# Altium schematic sheet testboard_chip1_wafertest.SchDoc
size E
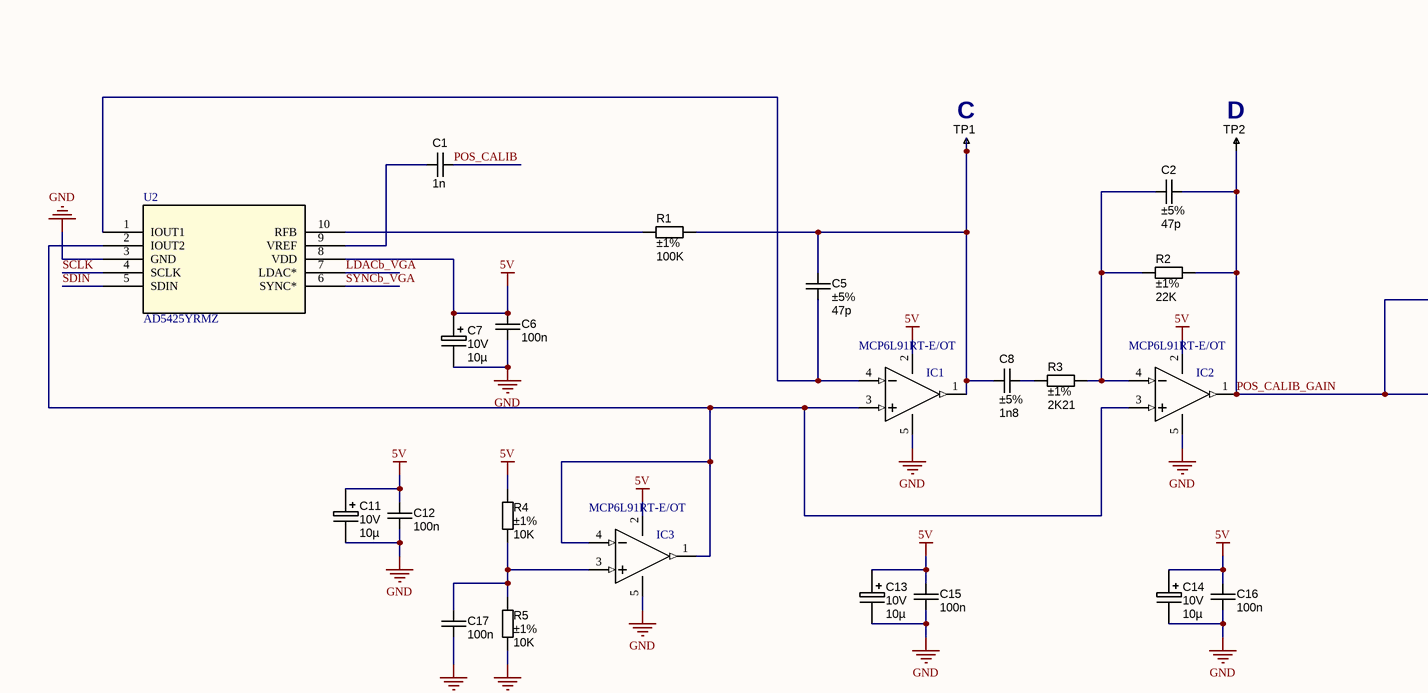
[diagram p0: testboard_chip1_wafertest.SchDoc, top left]
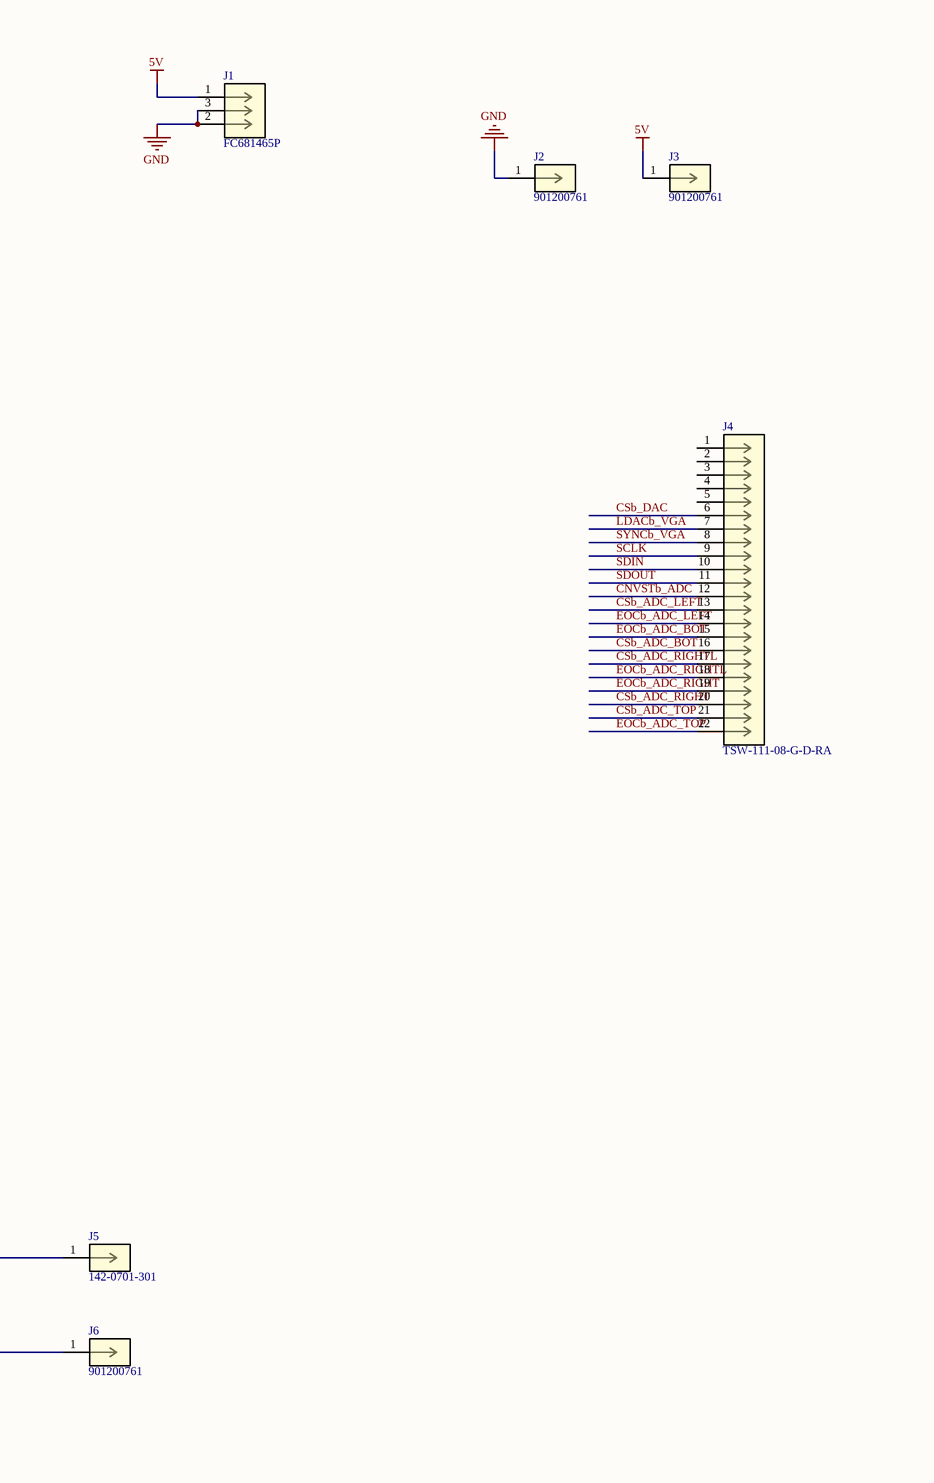
[diagram p1: testboard_chip1_wafertest.SchDoc, top middle]
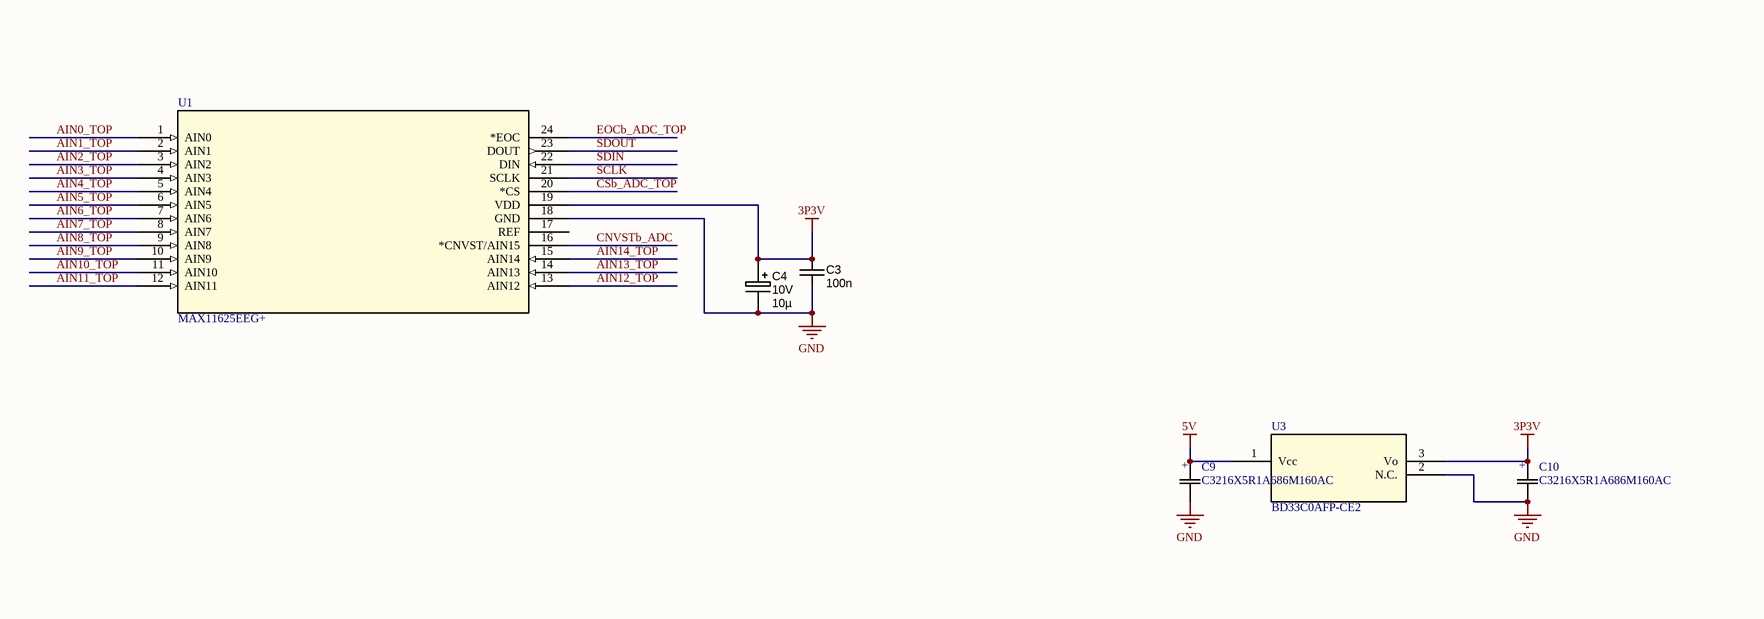
[diagram p2: testboard_chip1_wafertest.SchDoc, top right]
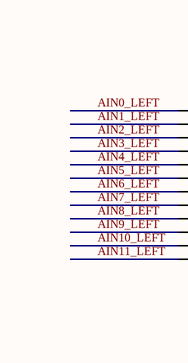
[diagram p3: testboard_chip1_wafertest.SchDoc, bottom left]
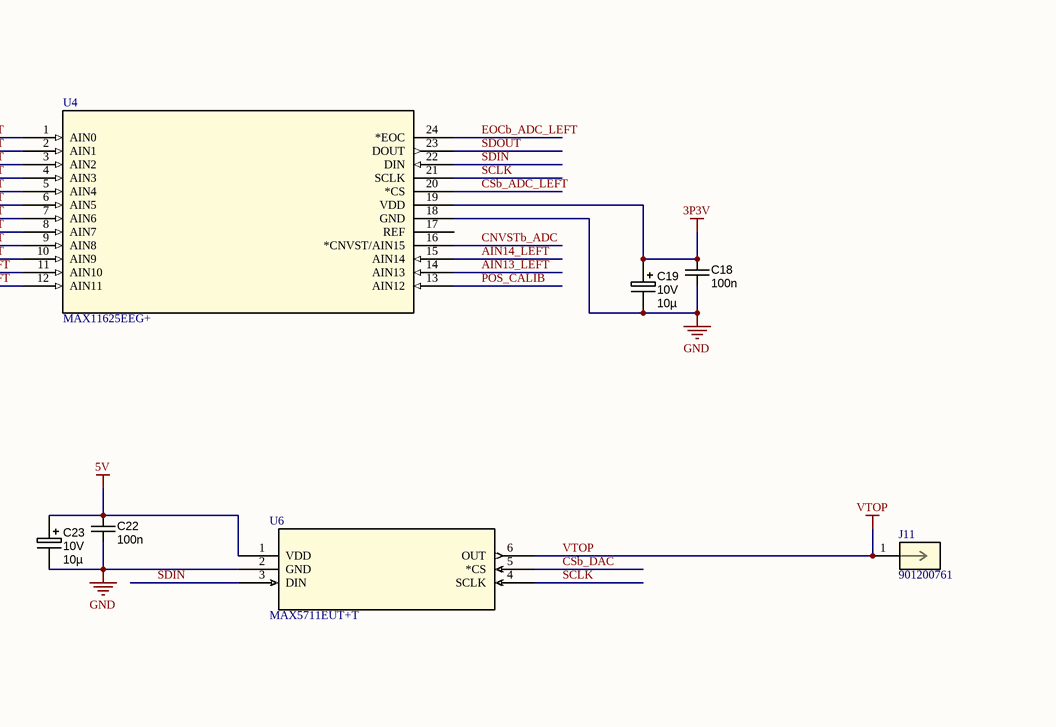
[diagram p4: testboard_chip1_wafertest.SchDoc, bottom middle]
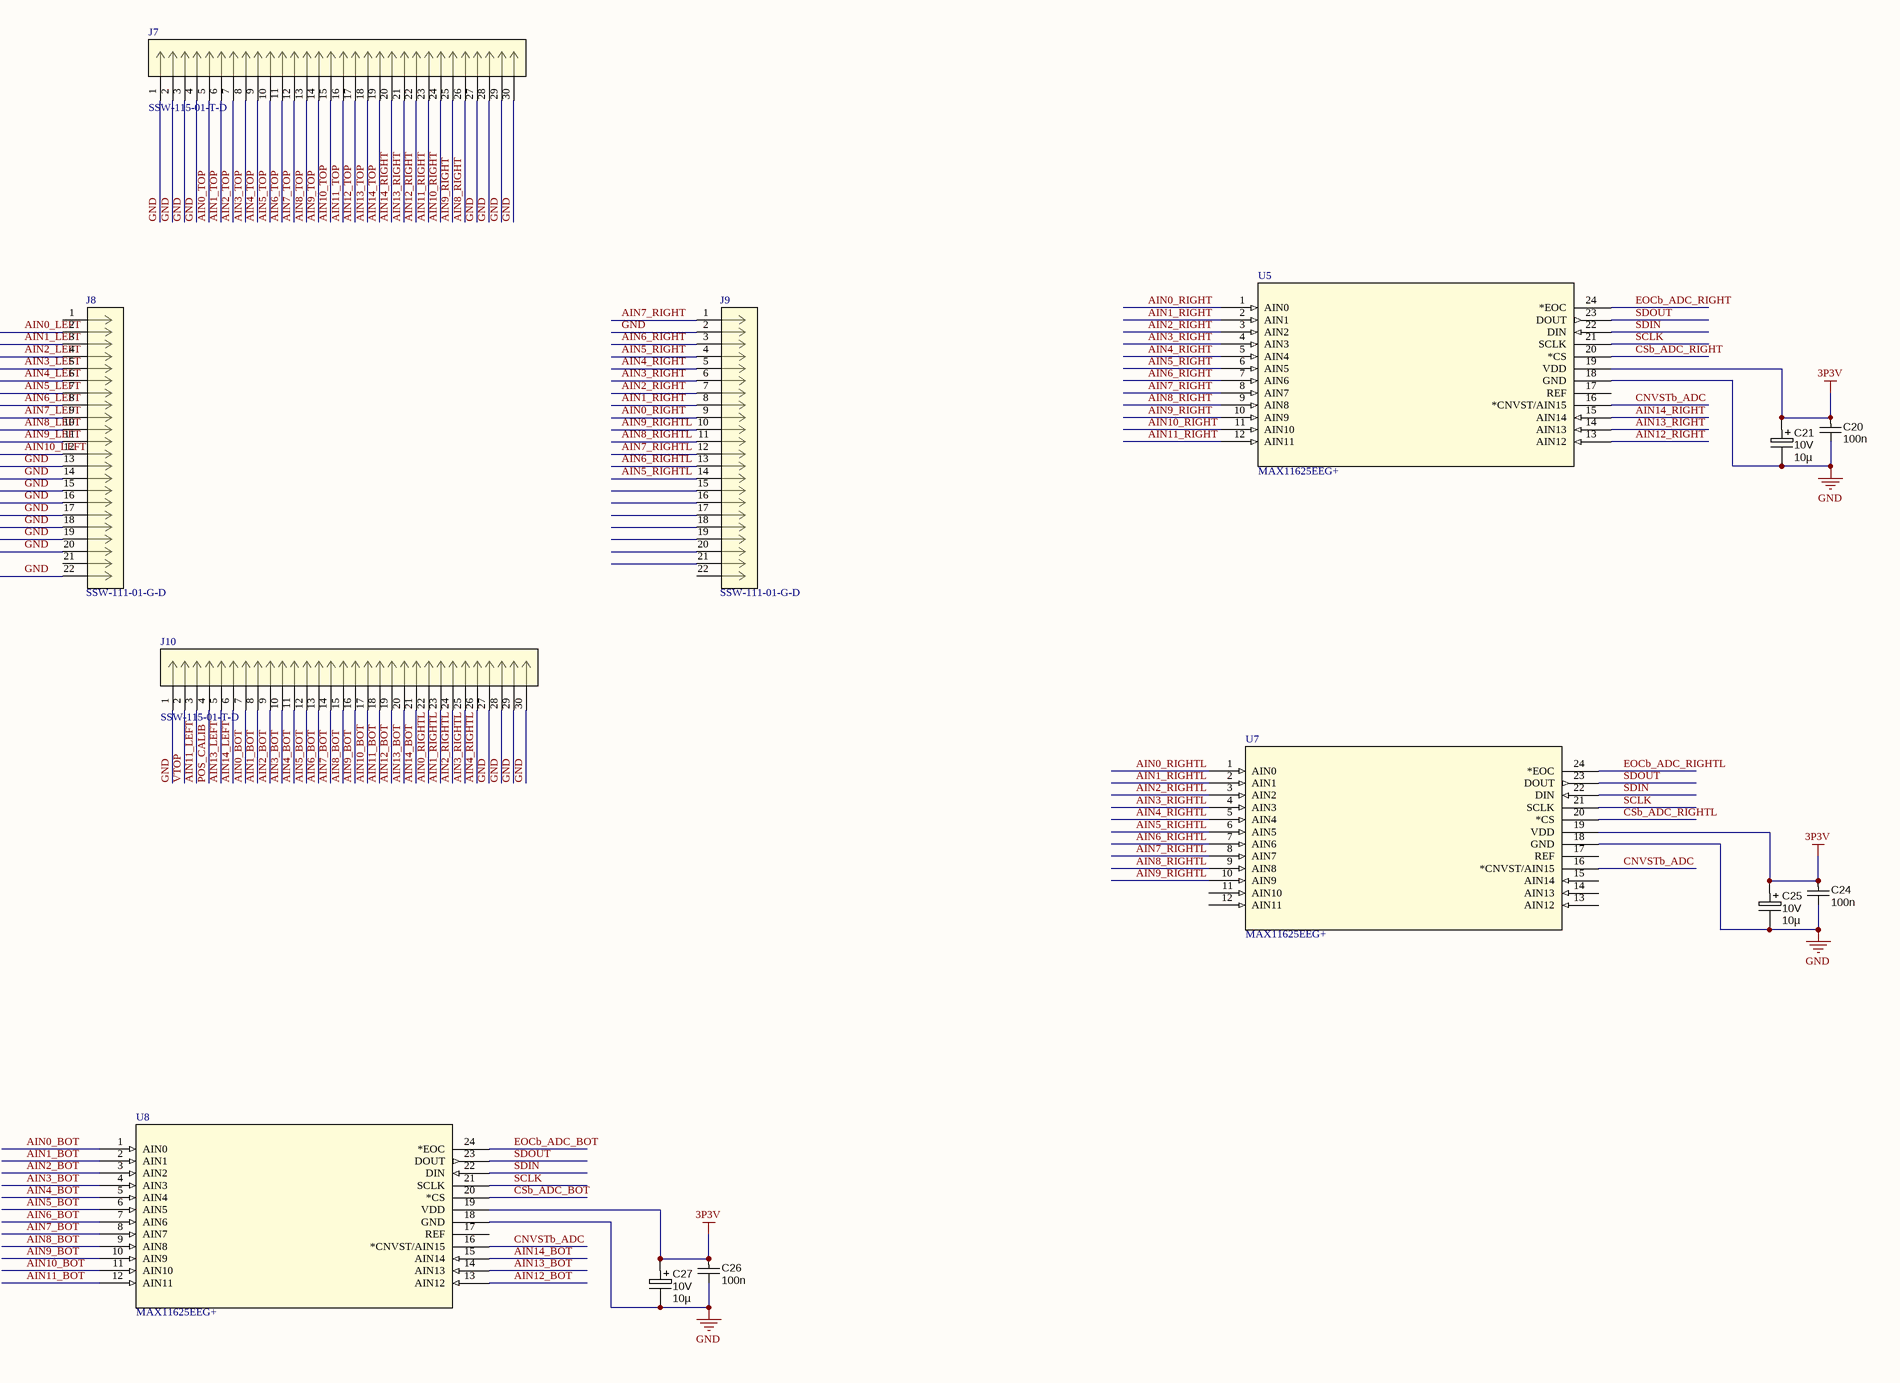
[diagram p5: testboard_chip1_wafertest.SchDoc, bottom right]

## Parts
C1  value 1n  [CAPC1608N]  (hidden comment: approved sub OK)
C2  Tolerance: ±5%  [CAPC1608N]  (hidden comment: 47p)
C3  value 100n  [CAPC1608N]  (hidden comment: approved sub OK)
C4  Ratings: 10V  [CAPMP2012X150USR]  (hidden comment: 10µ)
C5  Tolerance: ±5%  [CAPC1608N]  (hidden comment: 47p)
C6  value 100n  [CAPC1608N]  (hidden comment: approved sub OK)
C7  Ratings: 10V  [CAPMP2012X150USR]  (hidden comment: 10µ)
C8  Tolerance: ±5%  [CAPC1608N]  (hidden comment: 1n8)
C9  C3216X5R1A686M160AC  [CAP_3216_TDK]
C10  C3216X5R1A686M160AC  [CAP_3216_TDK]
C11  Ratings: 10V  [CAPMP2012X150USR]  (hidden comment: 10µ)
C12  value 100n  [CAPC1608N]  (hidden comment: approved sub OK)
C13  Ratings: 10V  [CAPMP2012X150USR]  (hidden comment: 10µ)
C14  Ratings: 10V  [CAPMP2012X150USR]  (hidden comment: 10µ)
C15  value 100n  [CAPC1608N]  (hidden comment: approved sub OK)
C16  value 100n  [CAPC1608N]  (hidden comment: approved sub OK)
C17  value 100n  [CAPC1608N]  (hidden comment: approved sub OK)
C18  value 100n  [CAPC1608N]  (hidden comment: approved sub OK)
C19  Ratings: 10V  [CAPMP2012X150USR]  (hidden comment: 10µ)
C20  value 100n  [CAPC1608N]  (hidden comment: approved sub OK)
C21  Ratings: 10V  [CAPMP2012X150USR]  (hidden comment: 10µ)
C22  value 100n  [CAPC1608N]  (hidden comment: approved sub OK)
C23  Ratings: 10V  [CAPMP2012X150USR]  (hidden comment: 10µ)
C24  value 100n  [CAPC1608N]  (hidden comment: approved sub OK)
C25  Ratings: 10V  [CAPMP2012X150USR]  (hidden comment: 10µ)
C26  value 100n  [CAPC1608N]  (hidden comment: approved sub OK)
C27  Ratings: 10V  [CAPMP2012X150USR]  (hidden comment: 10µ)
IC1  MCP6L91RT-E/OT  [SOT23-5]
IC2  MCP6L91RT-E/OT  [SOT23-5]
IC3  MCP6L91RT-E/OT  [SOT23-5]
J1  FC681465P  [CONN3_FC681465P_CLF]
J2  901200761  [CONN_90120-0761_MOL]
J3  901200761  [CONN_90120-0761_MOL]
J4  TSW-111-08-G-D-RA  [CON23_2X11_TR_TSW_SAI]
J5  142-0701-301  [CONN_142-0701-301_CIN]
J6  901200761  [CONN_90120-0761_MOL]
J7  SSW-115-01-T-D  [CON30_2X15_TU_SSQ]
J8  SSW-111-01-G-D  [CON23_2X11_TU_SSQ]
J9  SSW-111-01-G-D  [CON23_2X11_TU_SSQ]
J10  SSW-115-01-T-D  [CON30_2X15_TU_SSQ]
J11  901200761  [CONN_90120-0761_MOL]
R1  value 100K  Tolerance: ±1%  [RESC1608N]  (hidden comment: Thick Film)
R2  value 22K  Tolerance: ±1%  [RESC1608N]  (hidden comment: Thick Film)
R3  value 2K21  Tolerance: ±1%  [RESC1608N]  (hidden comment: Thick Film)
R4  value 10K  Tolerance: ±1%  [RESC1608N]  (hidden comment: Thick Film)
R5  value 10K  Tolerance: ±1%  [RESC1608N]  (hidden comment: Thick Film)
TP1  TESTPOINT_THT_MINI  [TP-THT-MINI]  (value not drawn)
TP2  TESTPOINT_THT_MINI  [TP-THT-MINI]  (value not drawn)
U1  MAX11625EEG+  [21-0055H_24_MXM]
U2  AD5425YRMZ  [RM_10_ADI]
U3  BD33C0AFP-CE2  [TO252-3_ROM]
U4  MAX11625EEG+  [21-0055H_24_MXM]
U5  MAX11625EEG+  [21-0055H_24_MXM]
U6  MAX5711EUT+T  [21-0058I_MXM]
U7  MAX11625EEG+  [21-0055H_24_MXM]
U8  MAX11625EEG+  [21-0055H_24_MXM]

## Nets
3P3V: C3.1 C4.1 C10.1 C18.1 C19.1 C20.1 C21.1 C24.1 C25.1 C26.1 C27.1 U1.19(VDD) U3.3(Vo) U4.19(VDD) U5.19(VDD) U7.19(VDD) U8.19(VDD)
5V: C6.1 C7.1 C9.1 C11.1 C12.1 C13.1 C14.1 C15.1 C16.1 C22.1 C23.1 IC1.2(V+) IC2.2(V+) IC3.2(V+) J1.1 J3.1 R4.1 U2.8(VDD) U3.1(Vcc) U6.1(VDD)
GND: C3.2 C4.2 C6.2 C7.2 C9.2 C10.2 C11.2 C12.2 C13.2 C14.2 C15.2 C16.2 C17.2 C18.2 C19.2 C20.2 C21.2 C22.2 C23.2 C24.2 C25.2 C26.2 C27.2 IC1.5(V-) IC2.5(V-) IC3.5(V-) J1.2 J1.3 J2.1 J7.1 J7.2 J7.3 J7.4 J7.27 J7.28 J7.29 J7.30 J8.13 J8.14 J8.15 J8.16 J8.17 J8.18 J8.19 J8.20 J8.22 J9.2 J10.1 J10.27 J10.28 J10.29 J10.30 R5.2 U1.18(GND) U2.3(GND) U3.2(N.C.) U4.18(GND) U5.18(GND) U6.2(GND) U7.18(GND) U8.18(GND)
VTOP: J10.2 J11.1 U6.6(OUT)
AIN0_BOT: J10.7 U8.1(AIN0)
AIN0_LEFT: J8.2 U4.1(AIN0)
AIN0_RIGHT: J9.9 U5.1(AIN0)
AIN0_RIGHTL: J10.22 U7.1(AIN0)
AIN0_TOP: J7.5 U1.1(AIN0)
AIN1_BOT: J10.8 U8.2(AIN1)
AIN1_LEFT: J8.3 U4.2(AIN1)
AIN1_RIGHT: J9.8 U5.2(AIN1)
AIN1_RIGHTL: J10.23 U7.2(AIN1)
AIN1_TOP: J7.6 U1.2(AIN1)
AIN2_BOT: J10.9 U8.3(AIN2)
AIN2_LEFT: J8.4 U4.3(AIN2)
AIN2_RIGHT: J9.7 U5.3(AIN2)
AIN2_RIGHTL: J10.24 U7.3(AIN2)
AIN2_TOP: J7.7 U1.3(AIN2)
AIN3_BOT: J10.10 U8.4(AIN3)
AIN3_LEFT: J8.5 U4.4(AIN3)
AIN3_RIGHT: J9.6 U5.4(AIN3)
AIN3_RIGHTL: J10.25 U7.4(AIN3)
AIN3_TOP: J7.8 U1.4(AIN3)
AIN4_BOT: J10.11 U8.5(AIN4)
AIN4_LEFT: J8.6 U4.5(AIN4)
AIN4_RIGHT: J9.5 U5.5(AIN4)
AIN4_RIGHTL: J10.26 U7.5(AIN4)
AIN4_TOP: J7.9 U1.5(AIN4)
AIN5_BOT: J10.12 U8.6(AIN5)
AIN5_LEFT: J8.7 U4.6(AIN5)
AIN5_RIGHT: J9.4 U5.6(AIN5)
AIN5_RIGHTL: J9.14 U7.6(AIN5)
AIN5_TOP: J7.10 U1.6(AIN5)
AIN6_BOT: J10.13 U8.7(AIN6)
AIN6_LEFT: J8.8 U4.7(AIN6)
AIN6_RIGHT: J9.3 U5.7(AIN6)
AIN6_RIGHTL: J9.13 U7.7(AIN6)
AIN6_TOP: J7.11 U1.7(AIN6)
AIN7_BOT: J10.14 U8.8(AIN7)
AIN7_LEFT: J8.9 U4.8(AIN7)
AIN7_RIGHT: J9.1 U5.8(AIN7)
AIN7_RIGHTL: J9.12 U7.8(AIN7)
AIN7_TOP: J7.12 U1.8(AIN7)
AIN8_BOT: J10.15 U8.9(AIN8)
AIN8_LEFT: J8.10 U4.9(AIN8)
AIN8_RIGHT: J7.26 U5.9(AIN8)
AIN8_RIGHTL: J9.11 U7.9(AIN8)
AIN8_TOP: J7.13 U1.9(AIN8)
AIN9_BOT: J10.16 U8.10(AIN9)
AIN9_LEFT: J8.11 U4.10(AIN9)
AIN9_RIGHT: J7.25 U5.10(AIN9)
AIN9_RIGHTL: J9.10 U7.10(AIN9)
AIN9_TOP: J7.14 U1.10(AIN9)
AIN10_BOT: J10.17 U8.11(AIN10)
AIN10_LEFT: J8.12 U4.11(AIN10)
AIN10_RIGHT: J7.24 U5.11(AIN10)
AIN10_TOP: J7.15 U1.11(AIN10)
AIN11_BOT: J10.18 U8.12(AIN11)
AIN11_LEFT: J10.3 U4.12(AIN11)
AIN11_RIGHT: J7.23 U5.12(AIN11)
AIN11_TOP: J7.16 U1.12(AIN11)
AIN12_BOT: J10.19 U8.13(AIN12)
AIN12_RIGHT: J7.22 U5.13(AIN12)
AIN12_TOP: J7.17 U1.13(AIN12)
AIN13_BOT: J10.20 U8.14(AIN13)
AIN13_LEFT: J10.5 U4.14(AIN13)
AIN13_RIGHT: J7.21 U5.14(AIN13)
AIN13_TOP: J7.18 U1.14(AIN13)
AIN14_BOT: J10.21 U8.15(AIN14)
AIN14_LEFT: J10.6 U4.15(AIN14)
AIN14_RIGHT: J7.20 U5.15(AIN14)
AIN14_TOP: J7.19 U1.15(AIN14)
CNVSTb_ADC: J4.12 U1.16(*CNVST/AIN15) U4.16(*CNVST/AIN15) U5.16(*CNVST/AIN15) U7.16(*CNVST/AIN15) U8.16(*CNVST/AIN15)
CSb_ADC_BOT: J4.16 U8.20(*CS)
CSb_ADC_LEFT: J4.13 U4.20(*CS)
CSb_ADC_RIGHT: J4.20 U5.20(*CS)
CSb_ADC_RIGHTL: J4.17 U7.20(*CS)
CSb_ADC_TOP: J4.21 U1.20(*CS)
CSb_DAC: J4.6 U6.5(*CS)
EOCb_ADC_BOT: J4.15 U8.24(*EOC)
EOCb_ADC_LEFT: J4.14 U4.24(*EOC)
EOCb_ADC_RIGHT: J4.19 U5.24(*EOC)
EOCb_ADC_RIGHTL: J4.18 U7.24(*EOC)
EOCb_ADC_TOP: J4.22 U1.24(*EOC)
LDACb_VGA: J4.7 U2.7(LDAC*)
POS_CALIB: C1.2 J10.4 U4.13(AIN12)
POS_CALIB_GAIN: C2.2 IC2.1(OUT) J5.1 J6.1 R2.2 TP2.1
SCLK: J4.9 U1.21(SCLK) U2.4(SCLK) U4.21(SCLK) U5.21(SCLK) U6.4(SCLK) U7.21(SCLK) U8.21(SCLK)
SDIN: J4.10 U1.22(DIN) U2.5(SDIN) U4.22(DIN) U5.22(DIN) U6.3(DIN) U7.22(DIN) U8.22(DIN)
SDOUT: J4.11 U1.23(DOUT) U4.23(DOUT) U5.23(DOUT) U7.23(DOUT) U8.23(DOUT)
SYNCb_VGA: J4.8 U2.6(SYNC*)
NetC1_1: C1.1 U2.9(VREF)
NetC2_1: C2.1 IC2.4(IN-) R2.1 R3.2
NetC5_1: C5.1 IC1.4(IN-) U2.1(IOUT1)
NetC5_2: C5.2 C8.1 IC1.1(OUT) R1.2 TP1.1
NetC8_2: C8.2 R3.1
NetC17_1: C17.1 IC3.3(IN+) R4.2 R5.1
NetIC1_3: IC1.3(IN+) IC2.3(IN+) IC3.1(OUT) IC3.4(IN-) U2.2(IOUT2)
NetR1_1: R1.1 U2.10(RFB)

Not connected (* = marked no-connect by the designer): J4 1 2 3 4 5; J8 1 21; J9 15 16 17 18 19 20 21 22; U1 17(REF); U4 17(REF); U5 17(REF); U7 11(AIN10) 12(AIN11) 13(AIN12) 14(AIN13) 15(AIN14) 17(REF); U8 17(REF)

## Notes on the sheet
- (near TP1) C
- (near TP2) D
- (in symbol C3216X5R1A686M160AC) +

## Library data of the parts
C1 = CAPC_1n_0603_100V: Capacitor SMD Cer 1nF 10% 100V X7R 0603; Manufacturer 1: Murata Electronics North America; Manufacturer Part Number 1: GCM188R72A102KA37D; Ratings: 100V; X7R; Material: ceramic; Package / Case: 0603 (1608 metric); Tolerance: ±10%; Supplier 1: Digi-Key; Supplier Part Number 1: 490-4780-1-ND; Operating Temperature: -55°C ~ 125°C; Size / Dimension: 0.063" L x 0.031" W (1.60mm x 0.80mm); Thickness (Max): 0.035" (0.90mm); ComponentLink1URL: http://search.murata.co.jp/Ceramy/image/img/PDF/ENG/GCM188R72A102KA37.pdf; ComponentLink1Description: http://search.murata.co.jp/Ceramy/image/img/PDF/ENG/GCM188R72A102KA37.pdf
C2 C5 = CAPC_47p_0603: Capacitor SMD Cer 47pF 0603; Ratings: 50V; NP0; Operating Temperature: -55°C ~ 125°C; Package / Case: 0603 (1608 Metric); Size / Dimension: 0.063" L x 0.031" W (1.60mm x 0.80mm); Thickness (Max): 0.037" (0.95mm); ComponentLink1URL: http://www.avx.com/docs/Catalogs/ccog.pdf; ComponentLink1Description: http://www.avx.com/docs/Catalogs/ccog.pdf; ComponentLink2URL: http://www.tdk.com/pdf/tight_tol_B11.pdf; ComponentLink2Description: http://www.tdk.com/pdf/tight_tol_B11.pdf; ComponentLink3URL: http://www.kemet.com/datasheets&C0603C221F5GACTU; ComponentLink3Description: http://www.kemet.com/datasheets&C0603C221F5GACTU; Value: 47p
C3 C6 C12 C15-C18 C20 C22 C24 C26 = CAPC_100n_0603: Capacitor SMD Cer 100nF 10% 50V X7R 0603; Manufacturer 1: AVX Corporation; Manufacturer Part Number 1: 06035C104KAT2A; Ratings: 50V; X7R; Material: ceramic; Manufacturer 2: TDK Corporation; Manufacturer Part Number 2: C1608X7R1H104K; Package / Case: 0603 (1608 Metric); Tolerance: ±10%; Supplier 1: Digi-Key; Supplier Part Number 1: 478-5052-1-ND; ComponentLink1URL: http://www.avx.com/docs/Catalogs/cx7r.pdf; ComponentLink1Description: http://www.avx.com/docs/Catalogs/cx7r.pdf; Supplier 2: Digi-Key; Supplier Part Number 2: 445-1314-1-ND; ComponentLink2URL: http://product.tdk.com/capacitor/mlcc/en/documents/mlcc_commercial_general_en.pdf; ComponentLink2Description: http://product.tdk.com/capacitor/mlcc/en/documents/mlcc_commercial_general_en.pdf
C4 C7 C11 C13 C14 C19 C21 C23 C25 C27 = CAPT_10u_0805_10V: Capacitor SMD Tantalum 10uF 20% 10V 0805; Manufacturer 1: AVX Corporation; Manufacturer Part Number 1: TAJP106M010RNJ; Package / Case: 0805 (2012 metric); Tolerance: ±20%; Material: Tantalum; Supplier 1: Digi-Key; Supplier Part Number 1: 478-3281-1-ND; Value: 10µ
C8 = CAPC_1n8_0603: Capacitor SMD Cer 1.8nF 0603; Ratings: 50V; NP0; Operating Temperature: -55°C ~ 125°C; Package / Case: 0603 (1608 Metric); Size / Dimension: 0.063" L x 0.031" W (1.60mm x 0.80mm); Thickness (Max): 0.037" (0.95mm); ComponentLink1URL: http://www.avx.com/docs/Catalogs/ccog.pdf; ComponentLink1Description: http://www.avx.com/docs/Catalogs/ccog.pdf; ComponentLink2URL: http://www.tdk.com/pdf/tight_tol_B11.pdf; ComponentLink2Description: http://www.tdk.com/pdf/tight_tol_B11.pdf; ComponentLink3URL: http://www.kemet.com/datasheets&C0603C221F5GACTU; ComponentLink3Description: http://www.kemet.com/datasheets&C0603C221F5GACTU; Value: 1n8
C9 C10 = C3216X5R1A686M160AC: No Description Available; Mfr_Name: TDK; Type: DEV; Copyright: Copyright (C) 2022 Ultra Librarian. All rights reserved.; Manufacturer_Part_Number: C3216X5R1A686M160AC; RefDes: RefDes
IC1-IC3 = MCP6L91RT-E/OT: 10MHz Opamp
J1 = FC681465P: No Description Available; Mfr_Name: Cliff; Copyright: Copyright (C) 2022 Ultra Librarian. All rights reserved.; Manufacturer_Part_Number: FC681465P; RefDes: RefDes; Type: DEV
J2 J3 J6 J11 = 901200761: No Description Available; Mfr_Name: Molex Connector Corporation; Copyright: Copyright (C) 2022 Ultra Librarian. All rights reserved.; Manufacturer_Part_Number: 901200761; RefDes: RefDes; Type: DEV
J4 = TSW-111-08-G-D-RA: No Description Available; Mfr_Name: Samtec Inc; Copyright: Copyright (C) 2022 Ultra Librarian. All rights reserved.; Manufacturer_Part_Number: TSW-111-08-G-D-RA; RefDes: RefDes; Type: DEV
J5 = 142-0701-301: No Description Available; Mfr_Name: Cinch Connectivity Solutions; Copyright: Copyright (C) 2022 Ultra Librarian. All rights reserved.; Manufacturer_Part_Number: 142-0701-301; RefDes: RefDes; Type: DEV
J7 J10 = SSW-115-01-T-D: No Description Available; Mfr_Name: Samtec Inc; Copyright: Copyright (C) 2022 Ultra Librarian. All rights reserved.; Manufacturer_Part_Number: SSW-115-01-T-D; RefDes: RefDes; Type: DEV
J8 J9 = SSW-111-01-G-D: No Description Available; Mfr_Name: Samtec Inc; Copyright: Copyright (C) 2022 Ultra Librarian. All rights reserved.; Manufacturer_Part_Number: SSW-111-01-G-D; RefDes: RefDes; Type: DEV
R1 = RES_100K_0603_1%: Resistor SMD chip 100k Ohm 0.1W 1% 0603; Manufacturer 1: Vishay/Dale; Manufacturer Part Number 1: CRCW0603100KFKEA; Ratings: 1/10W; Package / Case: 0603 (2012 metric); Supplier 1: Digi-Key; Supplier Part Number 1: 541-100KHCT-ND
R2 = RES_22K_0603_1%: Resistor SMD chip 22k Ohm 0.1W 1% 0603; Ratings: 1/10W; Package / Case: 0603 (1608 Metric)
R3 = RES_2K21_0603_1%: Resistor SMD chip 2.21k Ohm 0.1W 1% 0603; Ratings: 1/10W; Package / Case: 0603 (1608 Metric)
R4 R5 = RES_10K_0603_1%: Resistor SMD chip 10k Ohm 0.1W 1% 0603; Manufacturer 1: Yageo; Manufacturer Part Number 1: RC0603FR-0710KL; Ratings: 1/10W; Package / Case: 0603 (1608 Metric); Supplier 1: Digi-Key; Supplier Part Number 1: 311-10.0KHRCT-ND
TP1 TP2 = TESTPOINT_THT_MINI: Test Point PCB mount Miniature White; Manufacturer 1: Keystone Electronics; Manufacturer Part Number 1: 5002; Mounting Type: 0.040" (1.0mm) Hole Diameter; Material: Base, Nylon 46, UL 94V-0; Supplier 1: Digi-Key; Supplier Part Number 1: 5002K-ND
U1 U4 U5 U7 U8 = MAX11625EEG+: No Description Available; Mfr_Name: Maxim Integrated Products; Copyright: Copyright (C) 2022 Ultra Librarian. All rights reserved.; Manufacturer_Part_Number: MAX11625EEG+; RefDes: RefDes; Type: DEV
U2 = AD5425YRMZ: No Description Available; Built_By: EMA_UL_Team; Vendor: Analog Devices Inc; SourceLibrary: Analog_2012-01-01_3; Manufacturer_Part_Number: AD5425YRMZ; Copyright: Copyright (C) 2018 Accelerated Designs. All rights reserved; RefDes: RefDes; Type: DEV
U3 = BD33C0AFP-CE2: No Description Available; Mfr_Name: ROHM Semiconductor; Copyright: Copyright (C) 2022 Ultra Librarian. All rights reserved.; Manufacturer_Part_Number: BD33C0AFP-CE2; RefDes: RefDes; Type: DEV
U6 = MAX5711EUT+T: No Description Available; Mfr_Name: Maxim Integrated Products; Copyright: Copyright (C) 2022 Ultra Librarian. All rights reserved.; Manufacturer_Part_Number: MAX5711EUT+T; RefDes: RefDes; Type: DEV